# Altium project LED Driver.PrjPcb
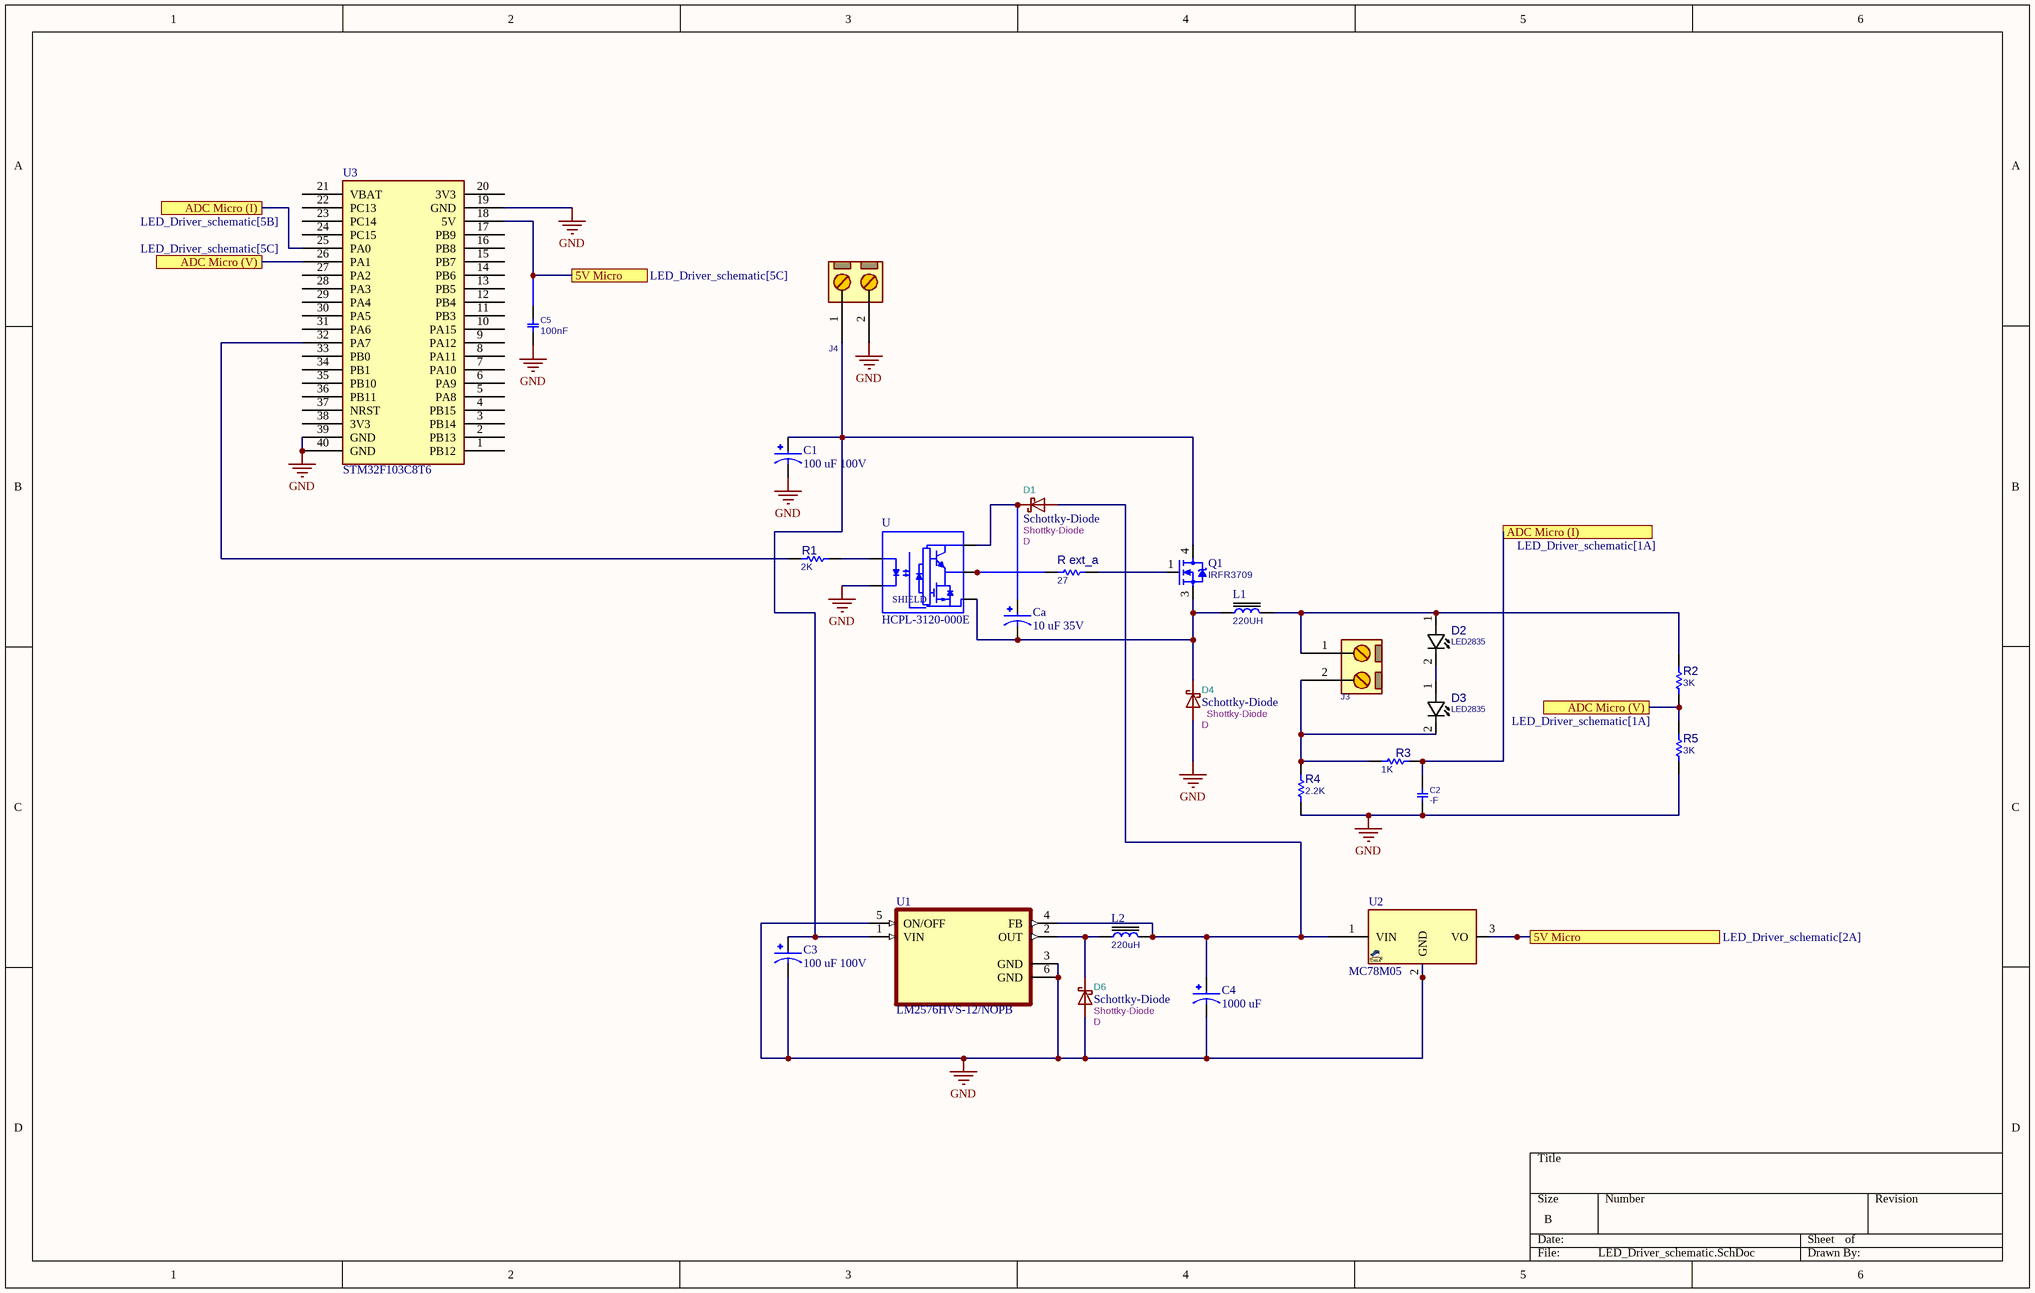
[diagram p0: LED_Driver_schematic.SchDoc]
1 sheet, 26 parts. Net scope: flat (ports and power ports of the same name join across sheets).
Board file: LED_Driver_PCB_N.PcbDoc

## Sheet LED_Driver_schematic.SchDoc
size B; SheetNumber: 1; SheetTotal: 1

### Parts
C1  value 100 uF 100V  [CAPPRD250W50D630H1250]  (hidden comment: UPM1C101MED)
C2  -F  [C0805]
C3  value 100 uF 100V  [CAPPRD250W50D630H1250]  (hidden comment: UPM1C101MED)
C4  value 1000 uF  [CAPPRD250W50D630H1250]  (hidden comment: UPM1C101MED)
C5  100nF  [C1206]
Ca  value 10 uF 35V  [CAPPRD250W50D630H1250]  (hidden comment: UPM1C101MED)
D1  Schottky-Diode  value Shottky-Diode  Reference: D  [DO-214AC_SMA]
D2  LED2835  [LED2835]
D3  LED2835  [LED2835]
D4  Schottky-Diode  value Shottky-Diode  Reference: D  [DO-214AC_SMA]
D6  Schottky-Diode  value Shottky-Diode  Reference: D  [DO-214AC_SMA]
J3  CONN_TB2  [MSTB_2]  (value not drawn)
J4  CONN_TB2  [MSTB_2]  (value not drawn)
L1  220UH  [L_12]
L2  220uH  [L_12]
Q1  IRFR3709  [DPAK_3]
R1  2K  [R0805]
R2  3K  [R0805]
R3  1K  [R0805]
R4  2.2K  [R2512]
R5  3K  [R0805]
R_ext_a  27  [R0805]
U  HCPL-3120-000E  [DIP762W65P254L990H470Q8]
U1  LM2576HVS-12/NOPB  [VREG_TPS79625KTTR]
U2  MC78M05  [TO220_3]
U3  STM32F103C8T6  [Stm32 BluePill]

### Ports
5V Micro (see LED_Driver_schematic[2A]), 5V Micro (see LED_Driver_schematic[5C]), ADC Micro (I) (see LED_Driver_schematic[1A]), ADC Micro (I) (see LED_Driver_schematic[5B]), ADC Micro (V) (see LED_Driver_schematic[1A]), ADC Micro (V) (see LED_Driver_schematic[5C])

### Nets
GND: C1.N C2.1 C3.N C4.N C5.1 D4.A D6.A J4.2 R4.1 R5.1 U.3(CATHODE) U1.3(GND) U1.5(ON/OFF) U1.6(GND) U2.2(GND) U3.19(GND) U3.39(GND) U3.40(GND)
NetC1_P: C1.P C3.P J4.1 Q1.4(D) U1.1(VIN)
NetC2_2: C2.2 R3.2 U3.25(PA0) ; port ADC Micro (I)
NetC4_P: C4.P D1.A L2.2 U1.4(FB) U2.1(VIN)
NetC5_2: C5.2 U2.3(VO) U3.18(5V) ; port 5V Micro
NetCa_N: Ca.N D4.K L1.1 Q1.3(S) U.5(VEE)
NetCa_P: Ca.P D1.K U.8(VCC)
NetD2_1: D2.1(ANODE) J3.1 L1.2 R2.2
NetD2_2: D2.2(CATHODE) D3.1(ANODE)
NetD3_2: D3.2(CATHODE) J3.2 R3.1 R4.2
NetD6_K: D6.K L2.1 U1.2(OUT)
NetQ1_1: Q1.1(G) R_ext_a.2
NetR1_1: R1.1 U3.32(PA7)
NetR1_2: R1.2 U.2(ANODE)
NetR2_1: R2.1 R5.2 U3.26(PA1) ; port ADC Micro (V)
NetR_ext_a_1: R_ext_a.1 U.6(VO) U.7(VO)

Not connected (* = marked no-connect by the designer): U3 1(PB12) 2(PB13) 3(PB14) 4(PB15) 5(PA8) 6(PA9) 7(PA10) 8(PA11) 9(PA12) 10(PA15) 11(PB3) 12(PB4) 13(PB5) 14(PB6) 15(PB7) 16(PB8) 17(PB9) 20(3V3) 21(VBAT) 22(PC13) 23(PC14) 24(PC15) 27(PA2) 28(PA3) 29(PA4) 30(PA5) 31(PA6) 33(PB0) 34(PB1) 35(PB10) 36(PB11) 37(NRST) 38(3V3)

### Notes on the sheet
- (in symbol HCPL-3120-000E) SHIELD

### Library data of the parts
C1 C3 C4 Ca = UPM1C101MED: 100ÂµF 16V Aluminum Electrolytic Capacitors Radial, Can 2000 Hrs @ 105Â°C; MF: Nichicon; Availability: Good; Check_prices: https://www.snapeda.com/parts/UPM1C101MED/Nichicon/view-part/226477/?ref=eda; SnapEDA_Link: https://www.snapeda.com/parts/UPM1C101MED/Nichicon/view-part/226477/?ref=snap; Price: None; MP: UPM1C101MED; Purchase-URL: https://pricing.snapeda.com/search/part/UPM1C101MED/?ref=eda; Package: Radial Nichicon
C2 = CAP_SMD_MLCC_0805: CAP, MLCC; PARAM: -, -%; MANF_P#: MANF_PART#; PARAM2: -V; PRICE: 100= 1$; MANF: -; ASSEMBLY: ASSEMBLY; VALUE: -F
C5 = CAP_SMD_MLCC_1206: CAP, MLCC; PARAM: -, -%; MANF_P#: MANF_PART#; PARAM2: -V; PRICE: 100= 1$; MANF: -; ASSEMBLY: ASSEMBLY; VALUE: 100nF
D1 D4 D6 = Schottky-Diode: ki_description: Schottky Diode; Datasheet: https://diotec.com/de/produktliste/SBD.html; ki_keywords: Schottky
D2 D3 = LED_SMD_2835: LED, SMD, 2835; DESC: DESCRIPTION; MANF_P#: MANF_PART#; PARAM2: 9V, 1W; MANF: MANF; ASSEMBLY: ASSEMBLY; PRICE: PRICE; VALUE: LED2835
J3 J4 = CONN_MSTB_2: CONN, PHOENIX MSTB, 5-G, 5.08mm pitch; PARAM2: 320V; PARAM: 12A; VALUE: CONN_TB2
L1 L2 = INDPWR_SMD: INDUCTOR, POWER, SMD
  L1: VALUE: 220UH
  L2: VALUE: 220uH
Q1 = MOSN_IRFR3709_DPAK: MOSFET, N-CH, 30V, 86A, 6.5mRDS, 2300pF; DESC: HEXFET Power MOSFET; MANF_P#: IRFR3709Z; PARAM2: 30VDS, 1.3~2.2VGSth; PARAM: 86A, 6.5mRDS, 2300pF, -55~175oC; ASSEMBLY: ASSEMBLY; PRICE: 1500t@PAYA; VALUE: IRFR3709
R1-R3 R5 R_ext_a = RES_SMD_0805: RESISTOR, SMD; PARAM: -W; DESC: DESCRIPTION; DIST#: MOUSER; PARAM2: 1%; MANF_P#: -; MANF: -; ASSEMBLY: ASSEMBLY; PRICE: 100= 0.5$
  R1: VALUE: 2K
  R2 R5: VALUE: 3K
  R3: VALUE: 1K
  R_ext_a: VALUE: 27
R4 = RES_SMD_2512: RESISTOR, SMD; PARAM: 1%, 1W; DESC: DESCRIPTION; DIST#: MOUSER; MANF_P#: -; MANF: -; ASSEMBLY: ASSEMBLY; PRICE: -; PARAM2: -; VALUE: 2.2K
U = HCPL-3120-000E: 2.5A Gate Driver Optical Coupling 3750Vrms 1 Channel 8-DIP; MF: Broadcom Limited; Package: DIP-8 Broadcom; Value: *; Price: None; MP: HCPL-3120-000E; Availability: Unavailable; SnapEDA_Link: https://www.snapeda.com/parts/HCPL-3120-000E/Broadcom%20Limited/view-part/1774478/?ref=snap
U1 = LM2576HVS-12/NOPB: SIMPLE SWITCHER&reg; 4V to 60V, 3A Low Component Count Step-Down Regulator 5-DDPAK/TO-263 -40 to 125; MF: Texas Instruments; SnapEDA_Link: https://www.snapeda.com/parts/LM2576HVS-12/Texas+Instruments/view-part/?ref=snap; Package: TO-263-5 Texas Instruments; MP: LM2576HVS-12; Check_prices: https://www.snapeda.com/parts/LM2576HVS-12/Texas+Instruments/view-part/?ref=eda; Purchase-URL: https://pricing.snapeda.com/search/part/LM2576HVS-12/?ref=eda; Price: None; Value: *; Availability: In Stock
U2 = VREG_78M05_TO220: REG, Linear, Fixed, 5v, 1.5A, TO-220; MANF_P#: LM78M05CT, LM7805CT, LM7805ACT, UA7805CKC, L7805ABV, L7805ACV, L7805CV, L78M05CV, KA78T05, KA7805ETU, MC78M05BT, MC78M05CT, MC7805ACT, MC7805ABT, NCP7805TG, NJM7805FA, TS7805CZ; MANF: TI, ST, FAIRCHILD, ON, NJR, TS; PARAM: 5v, 1.5A; PARAM2: PARAM2; VALUE: MC78M05
U3 = BluePill: Designed By @Alixahedi